# Altium schematic sheet speaker.SchDoc
size A4
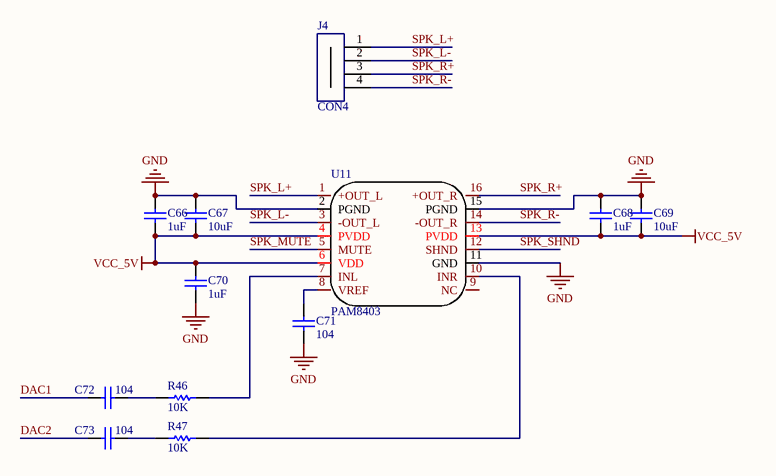
[diagram p0: speaker.SchDoc]

## Parts
C66  1uF  [C 0603]
C67  10uF  [C 0603]
C68  1uF  [C 0603]
C69  10uF  [C 0603]
C70  1uF  [C 0603]
C71  104  [C 0603]
C72  104  [C 0603]
C73  104  [C 0603]
J4  CON4  [SMD_4P-1.25]
R46  10K  [R 0603]
R47  10K  [R 0603]
U11  PAM8403  [SOP-16]

## Nets
GND: C66.2 C67.2 C68.2 C69.2 C70.1 C71.1 U11.2(PGND) U11.11(GND) U11.15(PGND)
VCC_5V: C66.1 C67.1 C68.1 C69.1 C70.2 U11.4(PVDD) U11.6(VDD) U11.13(PVDD)
DAC1: C72.2
DAC2: C73.2
SPK_L+: J4.1 U11.1(+OUT_L)
SPK_L-: J4.2 U11.3(-OUT_L)
SPK_MUTE: U11.5(MUTE)
SPK_R+: J4.3 U11.16(+OUT_R)
SPK_R-: J4.4 U11.14(-OUT_R)
SPK_SHND: U11.12(SHND)
NetC71_2: C71.2 U11.8(VREF)
NetC72_1: C72.1 R46.1
NetC73_1: C73.1 R47.1
NetR46_2: R46.2 U11.7(INL)
NetR47_2: R47.2 U11.10(INR)

Not connected (* = marked no-connect by the designer): U11 9(NC)

## Library data of the parts
C66-C73 = CAP
R46 R47 = RES